# Altium schematic sheet gydrodrive_main.SchDoc
size 297 x 209 mm; SheetNumber: 2; SheetTotal: 22
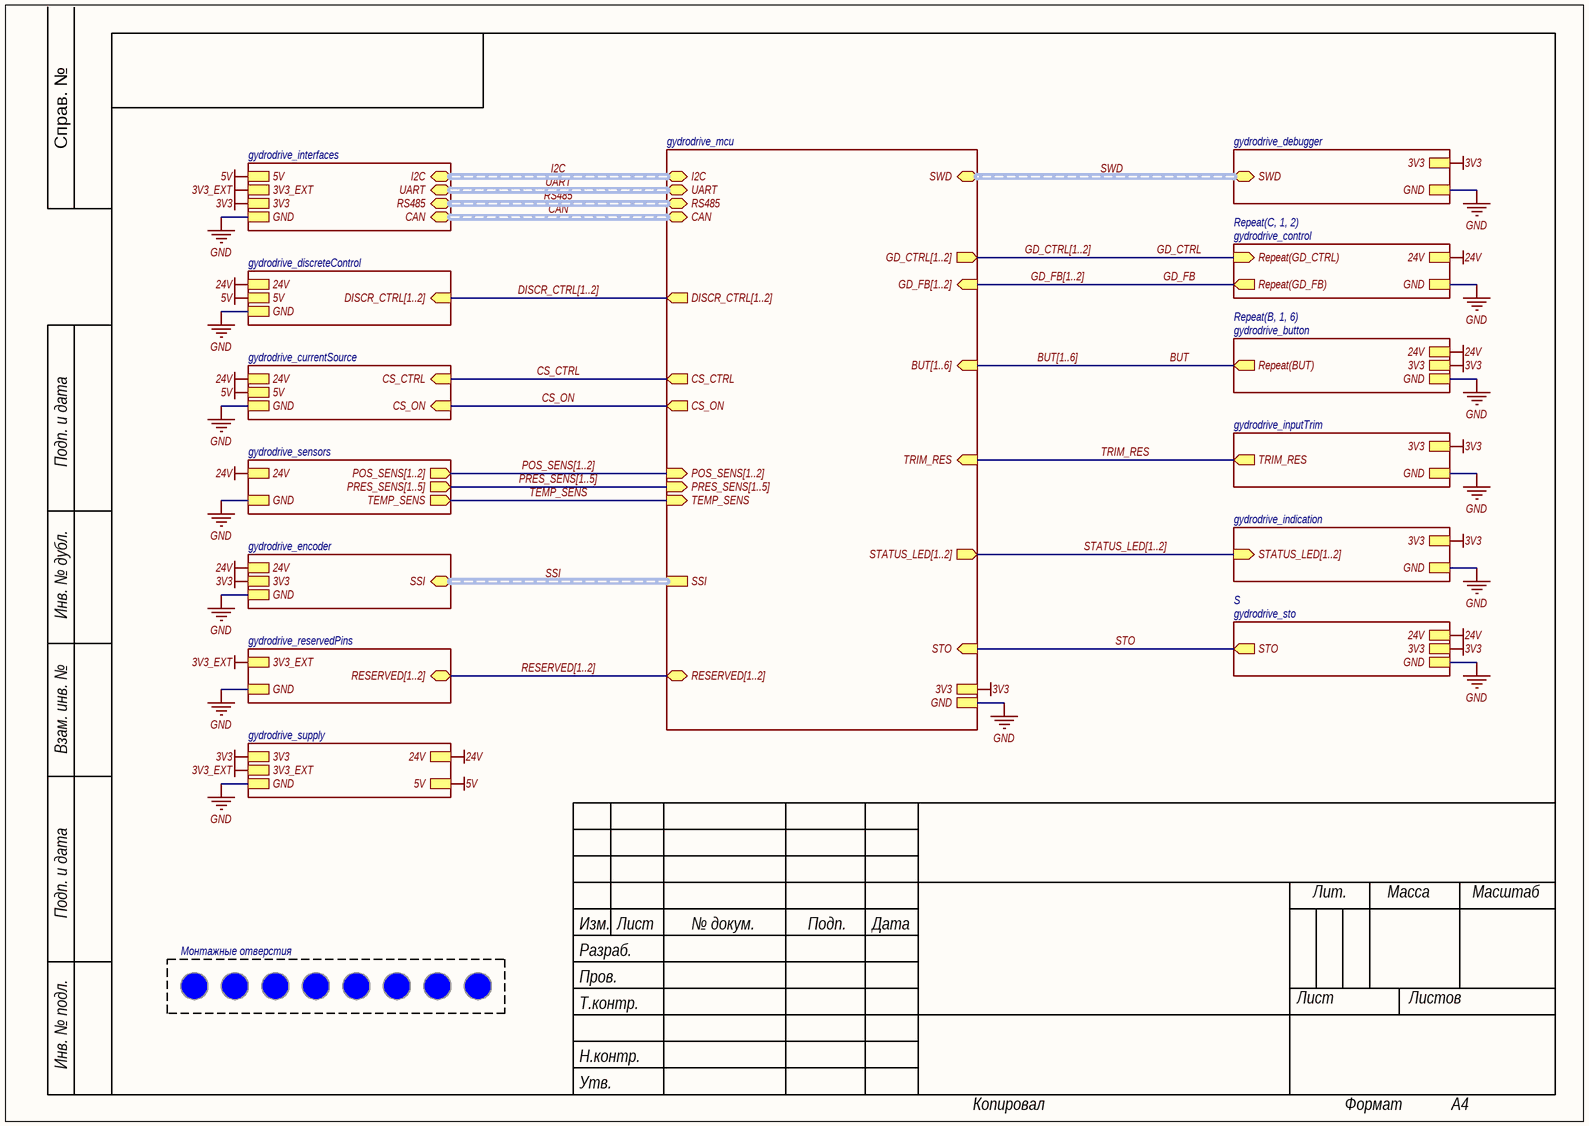
[diagram p0: gydrodrive_main.SchDoc]

## Parts
MH1  MH_3.2  [MH_3.2]  (value not drawn)  (no BOM)
MH2  MH_3.2  [MH_3.2]  (value not drawn)  (no BOM)
MH3  MH_3.2  [MH_3.2]  (value not drawn)  (no BOM)
MH4  MH_3.2  [MH_3.2]  (value not drawn)  (no BOM)
MH5  MH_3.2  [MH_3.2]  (value not drawn)  (no BOM)
MH6  MH_3.2  [MH_3.2]  (value not drawn)  (no BOM)
MH7  MH_3.2  [MH_3.2]  (value not drawn)  (no BOM)
MH8  MH_3.2  [MH_3.2]  (value not drawn)  (no BOM)

## Blocks framed on the sheet
Монтажные отверстия: MH1-MH8

## Sub-sheets
CS = gydrodrive_currentSource: CS_CTRL (in), 24V, GND, CS_ON (in), 5V
D = gydrodrive_discreteControl: 24V, GND, DISCR_CTRL[1..2] (in), 5V
DB = gydrodrive_debugger: SWD (bidir, harness SWD), GND, 3V3
EN = gydrodrive_encoder: SSI (bidir, harness SSI), 3V3, GND, 24V
I = gydrodrive_interfaces: CAN (bidir, harness CAN), RS485 (bidir, harness RS485), UART (bidir, harness UART), I2C (bidir, harness I2C), GND, 5V, 3V3, 3V3_EXT
IND = gydrodrive_indication: STATUS_LED[1..2] (in), GND, 3V3
M = gydrodrive_mcu: I2C (bidir, harness I2C), UART (bidir, harness UART), RS485 (bidir, harness RS485), CAN (bidir, harness CAN), TRIM_RES (in), BUT[1..6] (in), 3V3, GND, STATUS_LED[1..2] (out), STO (in), DISCR_CTRL[1..2] (out), SWD (bidir, harness SWD), GD_FB[1..2] (in), GD_CTRL[1..2] (out), CS_CTRL (out), POS_SENS[1..2] (in), PRES_SENS[1..5] (in), TEMP_SENS (in), CS_ON (out), RESERVED[1..2] (bidir), SSI (harness SSI)
P = gydrodrive_inputTrim: TRIM_RES (out), 3V3, GND
Repeat(B, 1, 6) = gydrodrive_button: Repeat(BUT) (out), 24V, GND, 3V3
Repeat(C, 1, 2) = gydrodrive_control: Repeat(GD_CTRL) (in), Repeat(GD_FB) (out), GND, 24V
RS = gydrodrive_reservedPins: GND, 3V3_EXT, RESERVED[1..2] (bidir)
S = gydrodrive_sto: STO (out), 24V, GND, 3V3
S = gydrodrive_sensors: PRES_SENS[1..5] (out), TEMP_SENS (out), POS_SENS[1..2] (out), 24V, GND
SP = gydrodrive_supply: 5V, GND, 3V3, 24V, 3V3_EXT

## Nets
3V3: sheet M/3V3, sheet SP/3V3, sheet DB/3V3, sheet Repeat(B, 1, 6)/3V3, sheet P/3V3, sheet IND/3V3, sheet S/3V3, sheet I/3V3, sheet EN/3V3
3V3_EXT: sheet SP/3V3_EXT, sheet I/3V3_EXT, sheet RS/3V3_EXT
5V: sheet SP/5V, sheet D/5V, sheet CS/5V, sheet I/5V
24V: sheet SP/24V, sheet Repeat(B, 1, 6)/24V, sheet Repeat(C, 1, 2)/24V, sheet D/24V, sheet S/24V, sheet CS/24V, sheet S/24V, sheet EN/24V
GND: sheet M/GND, sheet SP/GND, sheet DB/GND, sheet Repeat(B, 1, 6)/GND, sheet P/GND, sheet Repeat(C, 1, 2)/GND, sheet IND/GND, sheet D/GND, sheet S/GND, sheet CS/GND, sheet I/GND, sheet S/GND, sheet RS/GND, sheet EN/GND
BUT: sheet Repeat(B, 1, 6)/Repeat(BUT)
CS_CTRL: sheet M/CS_CTRL, sheet CS/CS_CTRL
CS_ON: sheet M/CS_ON, sheet CS/CS_ON
GD_CTRL: sheet Repeat(C, 1, 2)/Repeat(GD_CTRL)
GD_FB: sheet Repeat(C, 1, 2)/Repeat(GD_FB)
STO: sheet M/STO, sheet S/STO
TEMP_SENS: sheet M/TEMP_SENS, sheet S/TEMP_SENS
TRIM_RES: sheet M/TRIM_RES, sheet P/TRIM_RES

## Buses and harness runs
bus BUT[1..6] = sheet M/BUT[1..6]
bus DISCR_CTRL[1..2] = sheet D/DISCR_CTRL[1..2] = sheet M/DISCR_CTRL[1..2]
bus GD_CTRL[1..2] = sheet M/GD_CTRL[1..2]
bus GD_FB[1..2] = sheet M/GD_FB[1..2]
bus POS_SENS[1..2] = sheet M/POS_SENS[1..2] = sheet S/POS_SENS[1..2]
bus PRES_SENS[1..5] = sheet M/PRES_SENS[1..5] = sheet S/PRES_SENS[1..5]
bus RESERVED[1..2] = sheet M/RESERVED[1..2] = sheet RS/RESERVED[1..2]
bus STATUS_LED[1..2] = sheet IND/STATUS_LED[1..2] = sheet M/STATUS_LED[1..2]
harness CAN = sheet I/CAN = sheet M/CAN
harness I2C = sheet I/I2C = sheet M/I2C
harness RS485 = sheet I/RS485 = sheet M/RS485
harness SSI = sheet EN/SSI = sheet M/SSI
harness SWD = sheet DB/SWD = sheet M/SWD
harness UART = sheet I/UART = sheet M/UART

## Notes on the sheet
- Справ. №
- Подп. и дата
- Инв. № дубл.
- Взам. инв. №
- Изм.
- Лист
- № докум.
- Подп.
- Дата
- Лит.
- Масса
- Масштаб
- Разраб.
- Пров.
- Т.контр.
- Листов
- Инв. № подл.
- Н.контр.
- Утв.
- Копировал
- Формат
- A4

## Library data of the parts
MH1-MH8 = MH_3.2: Монтажное отверстие неметализированное 3.2 мм; Part Name: Монтажное отвертсие; Part Number: MH_3.2; Component Type: Standart (No BOM)